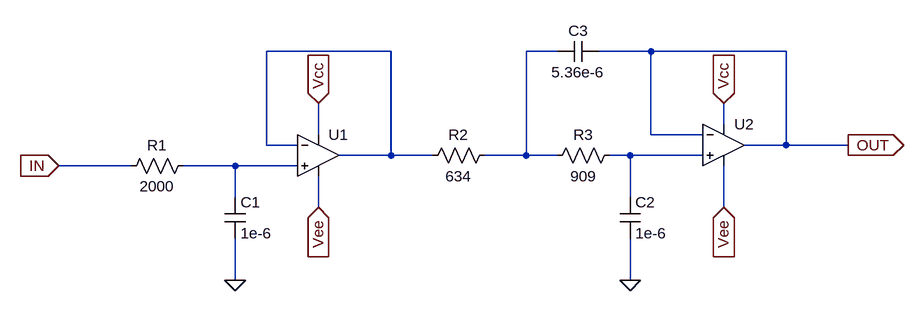
[diagram p0: schematic LowPassFilterSchematic.asc]
LowPassFilterSchematic.asc, the LTspice schematic file:
Version 4
SHEET 1 1076 680
WIRE 256 -112 64 -112
WIRE 512 -112 464 -112
WIRE 656 -112 576 -112
WIRE 864 -112 656 -112
WIRE 768 0 768 -32
WIRE 144 16 144 -32
WIRE 656 16 656 -112
WIRE 736 16 656 16
WIRE 64 32 64 -112
WIRE 112 32 64 32
WIRE 864 32 864 -112
WIRE 864 32 800 32
WIRE 960 32 864 32
WIRE 256 48 256 -112
WIRE 256 48 176 48
WIRE 320 48 256 48
WIRE 464 48 464 -112
WIRE 464 48 400 48
WIRE 512 48 464 48
WIRE 624 48 592 48
WIRE 736 48 624 48
WIRE -144 64 -256 64
WIRE 16 64 -64 64
WIRE 112 64 16 64
WIRE 16 112 16 64
WIRE 624 112 624 48
WIRE 144 128 144 80
WIRE 768 128 768 64
WIRE 16 240 16 176
WIRE 624 240 624 176
FLAG 16 240 0
FLAG 624 240 0
FLAG 960 32 OUT
IOPIN 960 32 Out
FLAG -256 64 IN
IOPIN -256 64 In
FLAG 144 -32 Vcc
IOPIN 144 -32 In
FLAG 768 -32 Vcc
IOPIN 768 -32 In
FLAG 144 128 Vee
IOPIN 144 128 In
FLAG 768 128 Vee
IOPIN 768 128 In
SYMBOL res -160 80 R270
WINDOW 0 32 56 VTop 2
WINDOW 3 0 56 VBottom 2
SYMATTR InstName R1
SYMATTR Value 2000
SYMATTR SpiceLine tol=1
SYMBOL res 416 32 R90
WINDOW 0 0 56 VBottom 2
WINDOW 3 32 56 VTop 2
SYMATTR InstName R2
SYMATTR Value 634
SYMATTR SpiceLine tol=1
SYMBOL res 608 32 R90
WINDOW 0 0 56 VBottom 2
WINDOW 3 32 56 VTop 2
SYMATTR InstName R3
SYMATTR Value 909
SYMATTR SpiceLine tol=1
SYMBOL cap 0 112 R0
SYMATTR InstName C1
SYMATTR Value 1e-6
SYMBOL cap 608 112 R0
SYMATTR InstName C2
SYMATTR Value 1e-6
SYMBOL cap 576 -128 R90
WINDOW 0 0 32 VBottom 2
WINDOW 3 32 32 VTop 2
SYMATTR InstName C3
SYMATTR Value 5.36e-6
SYMBOL OpAmps\\UniversalOpAmp 144 48 R0
SYMATTR InstName U1
SYMATTR Value2 Avol=1Meg GBW=0.027Meg Vos=0
SYMBOL OpAmps\\UniversalOpAmp 768 32 R0
SYMATTR InstName U2
SYMATTR Value2 Avol=1Meg GBW=0.027Meg Vos=0

The netlist it stands for:
* LowPassFilterSchematic.asc
R1 IN N004 2000 tol=1
R2 N002 N001 634 tol=1
R3 N003 N002 909 tol=1
C1 N004 0 1e-6
C2 N003 0 1e-6
C3 OUT N002 5.36e-6
XU1 N004 N001 Vcc Vee N001 level1 Avol=1Meg GBW=0.027Meg Vos=0 En=0 Enk=0 In=0 Ink=0 Rin=500Meg  ; pins In+ In- V+ V- OUT
XU2 N003 OUT Vcc Vee OUT level1 Avol=1Meg GBW=0.027Meg Vos=0 En=0 Enk=0 In=0 Ink=0 Rin=500Meg  ; pins In+ In- V+ V- OUT
.lib UniversalOpAmp1.lib
.backanno
.end